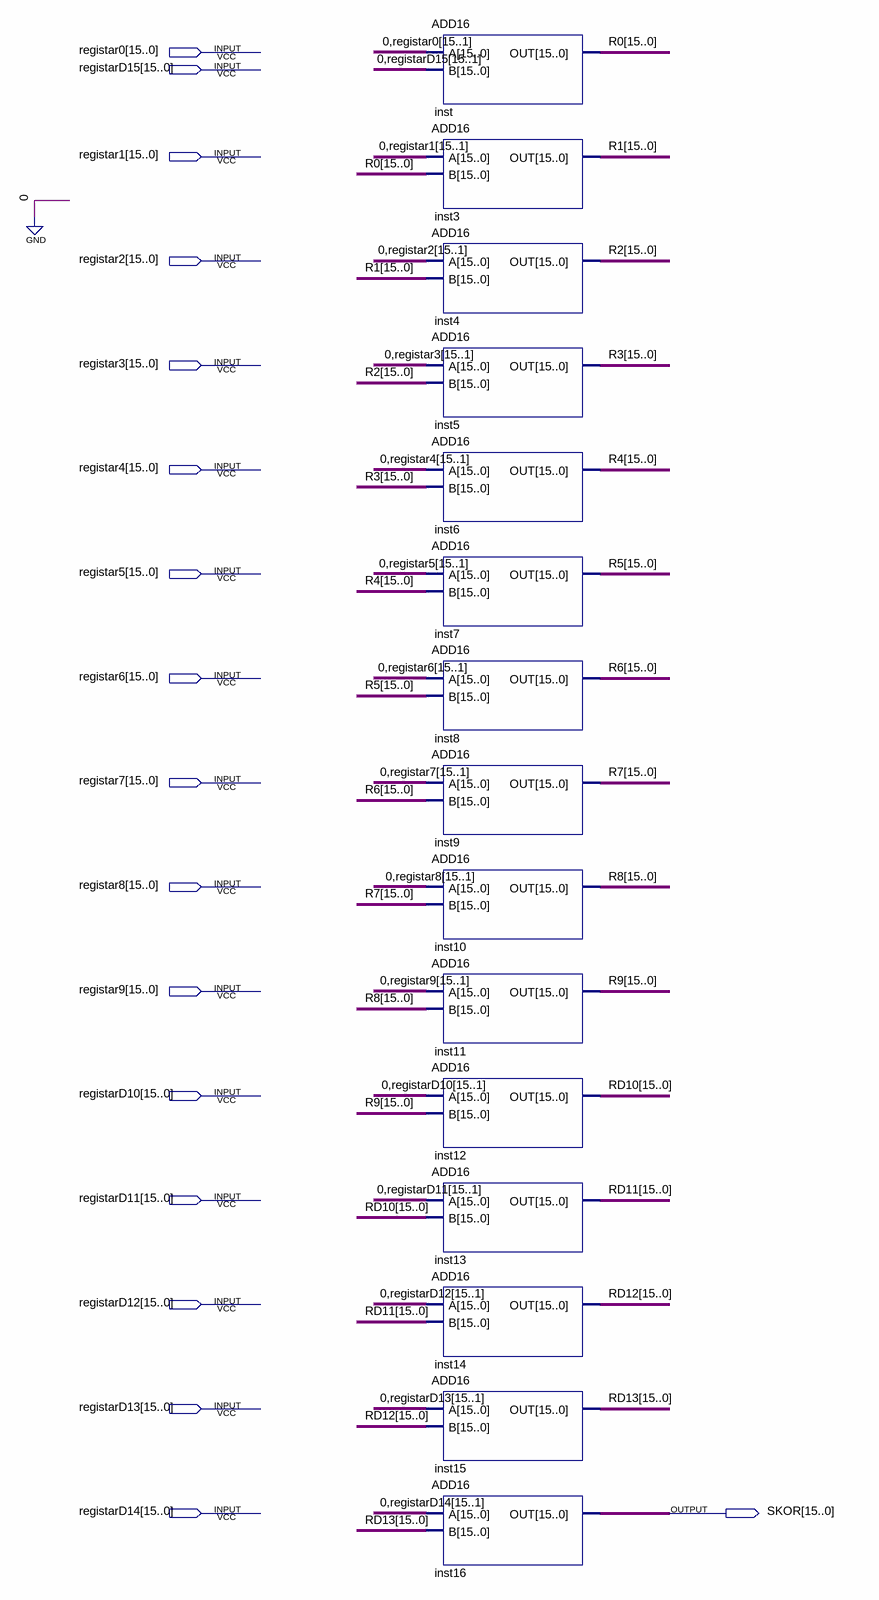
[diagram p0: schematic sheet]
// Quartus schematic Skor.bdf as structural Verilog: 15 symbols, 17 pins
module Skor (
  input  [15:0] registar0,
  input  [15:0] registarD15,
  input  [15:0] registar1,
  input  [15:0] registar2,
  input  [15:0] registar3,
  input  [15:0] registar4,
  input  [15:0] registar5,
  input  [15:0] registar6,
  input  [15:0] registar7,
  input  [15:0] registar8,
  input  [15:0] registar9,
  input  [15:0] registarD10,
  input  [15:0] registarD11,
  input  [15:0] registarD12,
  input  [15:0] registarD13,
  input  [15:0] registarD14,
  output [15:0] SKOR
);

  wire [15:0] R0, R1, R2, R3, R4, R5, R6, R7, R8, R9, RD10, RD11, RD12, RD13;

  ADD16 inst (.A({1'b0, registar0[15:1]}), .B({1'b0, registarD15[15:1]}), .OUT(R0));
  ADD16 inst3 (.A({1'b0, registar1[15:1]}), .B(R0), .OUT(R1));
  ADD16 inst4 (.A({1'b0, registar2[15:1]}), .B(R1), .OUT(R2));
  ADD16 inst5 (.A({1'b0, registar3[15:1]}), .B(R2), .OUT(R3));
  ADD16 inst6 (.A({1'b0, registar4[15:1]}), .B(R3), .OUT(R4));
  ADD16 inst7 (.A({1'b0, registar5[15:1]}), .B(R4), .OUT(R5));
  ADD16 inst8 (.A({1'b0, registar6[15:1]}), .B(R5), .OUT(R6));
  ADD16 inst9 (.A({1'b0, registar7[15:1]}), .B(R6), .OUT(R7));
  ADD16 inst10 (.A({1'b0, registar8[15:1]}), .B(R7), .OUT(R8));
  ADD16 inst11 (.A({1'b0, registar9[15:1]}), .B(R8), .OUT(R9));
  ADD16 inst12 (.A({1'b0, registarD10[15:1]}), .B(R9), .OUT(RD10));
  ADD16 inst13 (.A({1'b0, registarD11[15:1]}), .B(RD10), .OUT(RD11));
  ADD16 inst14 (.A({1'b0, registarD12[15:1]}), .B(RD11), .OUT(RD12));
  ADD16 inst15 (.A({1'b0, registarD13[15:1]}), .B(RD12), .OUT(RD13));
  ADD16 inst16 (.A({1'b0, registarD14[15:1]}), .B(RD13), .OUT(SKOR));
endmodule
